# EasyEDA schematic SCH_XT60 Power Bar 9X.json
TITLE: Power Bar 9X; REV: 1.0; Date: 2023-09-10; Sheet: 1/1; Company: DF3MT
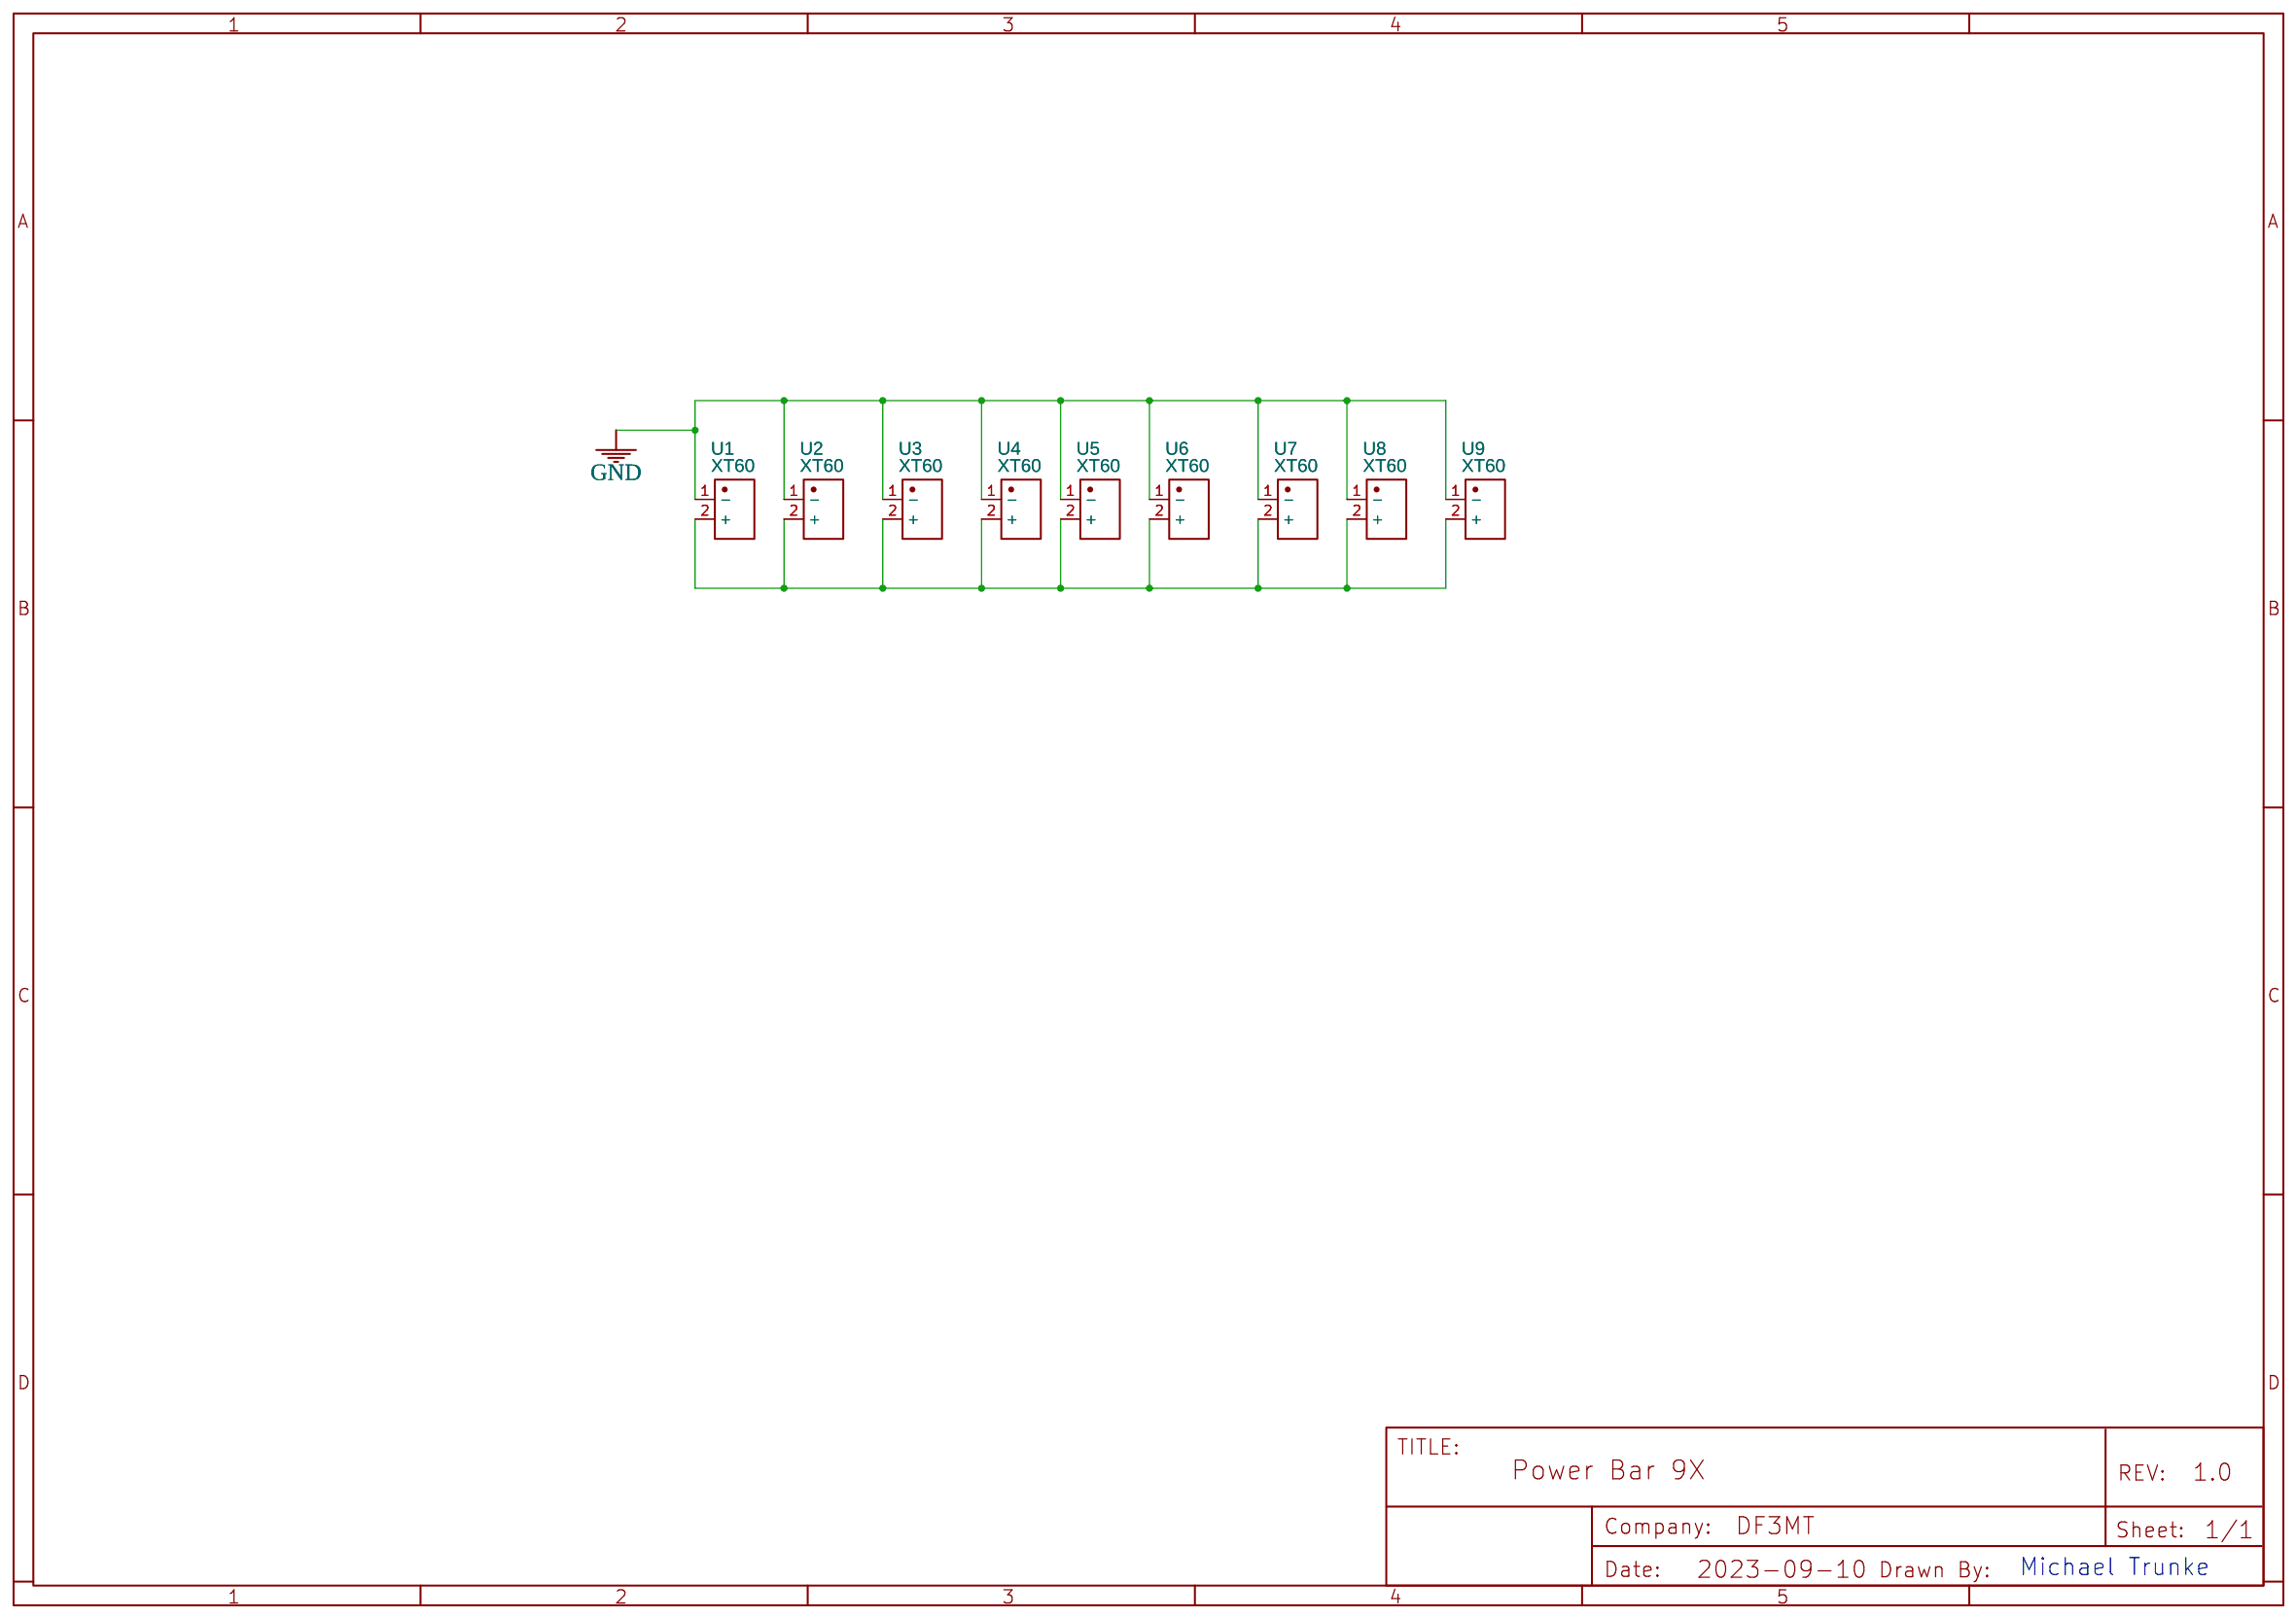
[diagram p0: schematic sheet]

## Parts
U1  XT60  [CONN-TH_XT60]
U2  XT60  [CONN-TH_XT60]
U3  XT60  [CONN-TH_XT60]
U4  XT60  [CONN-TH_XT60]
U5  XT60  [CONN-TH_XT60]
U6  XT60  [CONN-TH_XT60]
U7  XT60  [CONN-TH_XT60]
U8  XT60  [CONN-TH_XT60]
U9  XT60  [CONN-TH_XT60]

## Library data of the parts
U1-U9 = XT60: Supplier: LCSC; Supplier Part: C98733; Manufacturer: AMASS(艾迈斯); link: https://atta.szlcsc.com/upload/public/pdf/source/20170606/1496716524919.pdf; JLCPCB Part Class: Extended Part; Contributor: lcsc

## Nets
GND: U1.1(-) U2.1(-) U3.1(-) U4.1(-) U5.1(-) U6.1(-) U7.1(-) U8.1(-) U9.1(-)
Net-(U1-2): U1.2(+) U2.2(+) U3.2(+) U4.2(+) U5.2(+) U6.2(+) U7.2(+) U8.2(+) U9.2(+)

## Notes on the sheet
- Michael Trunke
